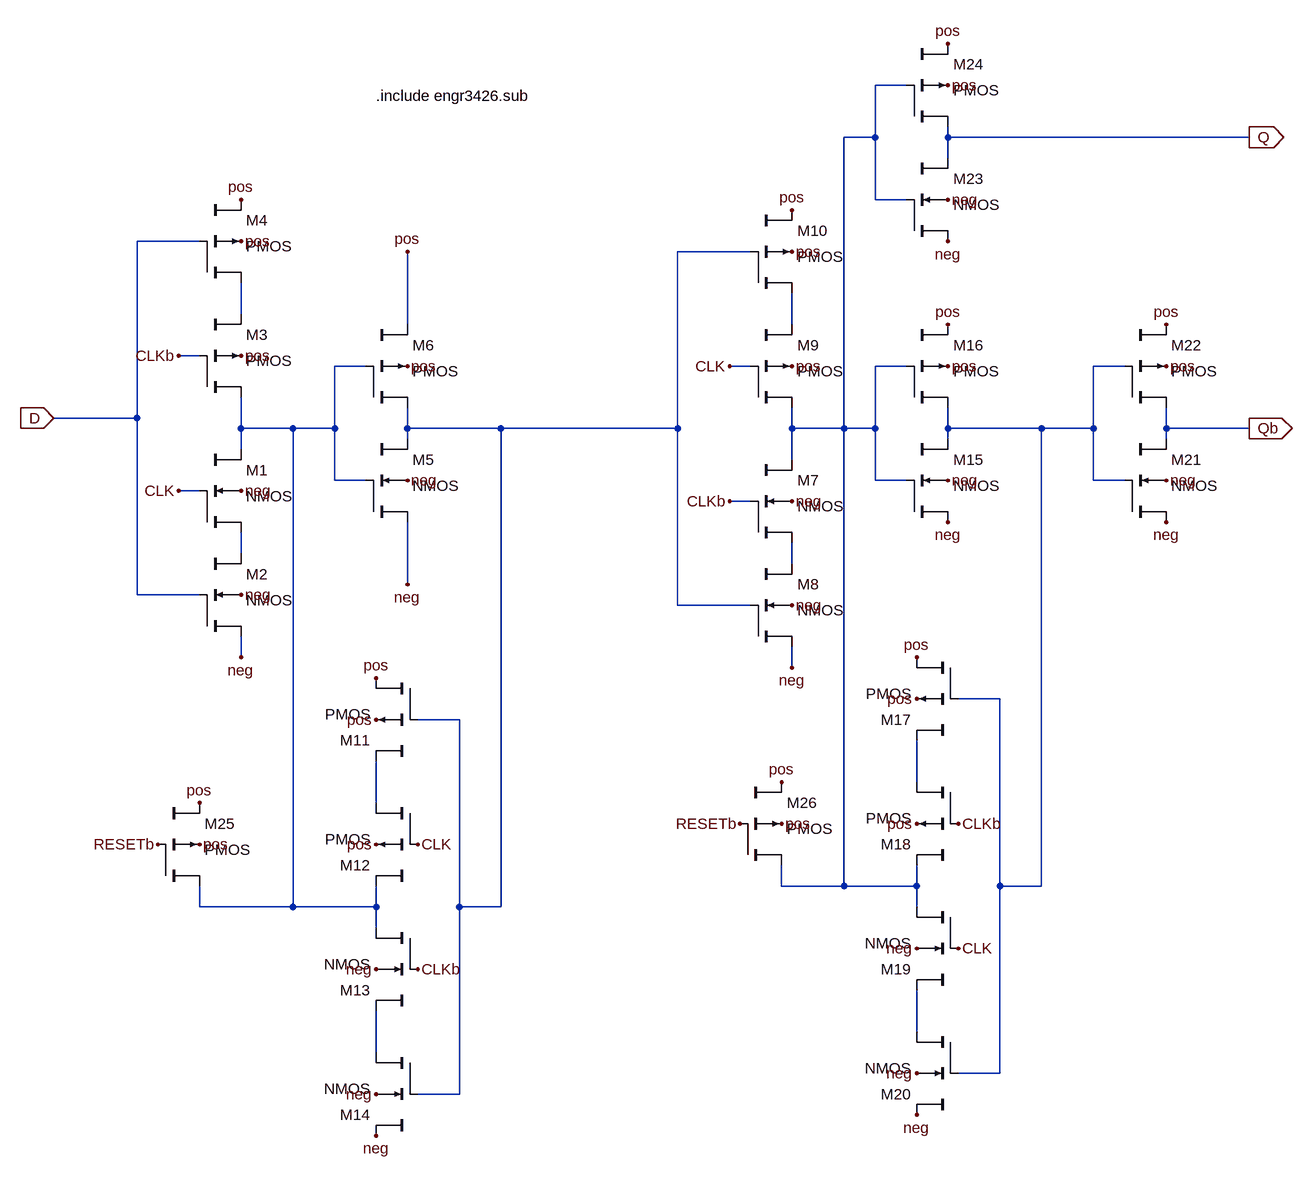
[diagram p0: schematic FlipFlop.asc]
FlipFlop.asc, the LTspice schematic file:
Version 4
SHEET 1 880 680
WIRE -656 -1440 -704 -1440
WIRE -704 -1360 -704 -1440
WIRE -704 -1360 -752 -1360
WIRE -592 -1360 -592 -1376
WIRE -128 -1360 -592 -1360
WIRE -592 -1328 -592 -1360
WIRE -704 -1264 -704 -1360
WIRE -656 -1264 -704 -1264
WIRE -1744 -1200 -1840 -1200
WIRE -896 -1184 -1008 -1184
WIRE -1680 -1088 -1680 -1136
WIRE -1424 -1072 -1424 -1184
WIRE -832 -1072 -832 -1120
WIRE -1744 -1024 -1776 -1024
WIRE -1488 -1008 -1536 -1008
WIRE -896 -1008 -928 -1008
WIRE -656 -1008 -704 -1008
WIRE -320 -1008 -368 -1008
WIRE -1840 -928 -1840 -1200
WIRE -1840 -928 -1968 -928
WIRE -1680 -912 -1680 -960
WIRE -1600 -912 -1680 -912
WIRE -1536 -912 -1536 -1008
WIRE -1536 -912 -1600 -912
WIRE -1424 -912 -1424 -944
WIRE -1280 -912 -1424 -912
WIRE -1008 -912 -1008 -1184
WIRE -1008 -912 -1280 -912
WIRE -832 -912 -832 -944
WIRE -752 -912 -752 -1360
WIRE -752 -912 -832 -912
WIRE -704 -912 -704 -1008
WIRE -704 -912 -752 -912
WIRE -592 -912 -592 -944
WIRE -448 -912 -592 -912
WIRE -368 -912 -368 -1008
WIRE -368 -912 -448 -912
WIRE -256 -912 -256 -944
WIRE -128 -912 -256 -912
WIRE -1424 -896 -1424 -912
WIRE -592 -896 -592 -912
WIRE -256 -896 -256 -912
WIRE -1680 -880 -1680 -912
WIRE -832 -864 -832 -912
WIRE -1536 -832 -1536 -912
WIRE -1488 -832 -1536 -832
WIRE -704 -832 -704 -912
WIRE -656 -832 -704 -832
WIRE -368 -832 -368 -912
WIRE -320 -832 -368 -832
WIRE -1744 -816 -1776 -816
WIRE -896 -800 -928 -800
WIRE -1680 -720 -1680 -752
WIRE -832 -704 -832 -736
WIRE -1424 -672 -1424 -768
WIRE -1840 -656 -1840 -928
WIRE -1744 -656 -1840 -656
WIRE -1008 -640 -1008 -912
WIRE -896 -640 -1008 -640
WIRE -1680 -560 -1680 -592
WIRE -832 -544 -832 -576
WIRE -512 -496 -576 -496
WIRE -1344 -464 -1408 -464
WIRE -640 -368 -640 -432
WIRE -1472 -336 -1472 -400
WIRE -848 -208 -848 -240
WIRE -752 -208 -752 -912
WIRE -752 -208 -848 -208
WIRE -640 -208 -640 -240
WIRE -640 -208 -752 -208
WIRE -512 -208 -512 -496
WIRE -448 -208 -448 -912
WIRE -448 -208 -512 -208
WIRE -1744 -176 -1744 -208
WIRE -1600 -176 -1600 -912
WIRE -1600 -176 -1744 -176
WIRE -1472 -176 -1472 -208
WIRE -1472 -176 -1600 -176
WIRE -1344 -176 -1344 -464
WIRE -1280 -176 -1280 -912
WIRE -1280 -176 -1344 -176
WIRE -640 -176 -640 -208
WIRE -1472 -144 -1472 -176
WIRE -640 16 -640 -48
WIRE -1472 48 -1472 -16
WIRE -512 80 -512 -208
WIRE -512 80 -576 80
WIRE -1344 112 -1344 -176
WIRE -1344 112 -1408 112
FLAG -1680 -1264 pos
FLAG -1968 -928 D
IOPIN -1968 -928 In
FLAG -1776 -1024 CLKb
FLAG -1776 -816 CLK
FLAG -1680 -1024 pos
FLAG -1680 -1200 pos
FLAG -1680 -816 neg
FLAG -1680 -656 neg
FLAG -1680 -560 neg
FLAG -1424 -1184 pos
FLAG -1424 -1008 pos
FLAG -1424 -832 neg
FLAG -1424 -672 neg
FLAG -832 -1248 pos
FLAG -832 -1008 pos
FLAG -832 -1184 pos
FLAG -832 -800 neg
FLAG -832 -640 neg
FLAG -832 -544 neg
FLAG -1472 -528 pos
FLAG -1472 -464 pos
FLAG -1472 -272 pos
FLAG -1472 176 neg
FLAG -1472 112 neg
FLAG -1472 -80 neg
FLAG -592 -1008 pos
FLAG -592 -832 neg
FLAG -640 -560 pos
FLAG -640 -496 pos
FLAG -640 -304 pos
FLAG -640 144 neg
FLAG -640 80 neg
FLAG -640 -112 neg
FLAG -592 -768 neg
FLAG -592 -1072 pos
FLAG -256 -1008 pos
FLAG -256 -832 neg
FLAG -256 -768 neg
FLAG -256 -1072 pos
FLAG -128 -912 Qb
IOPIN -128 -912 Out
FLAG -128 -1360 Q
IOPIN -128 -1360 Out
FLAG -928 -1008 CLK
FLAG -928 -800 CLKb
FLAG -1408 -272 CLK
FLAG -1408 -80 CLKb
FLAG -576 -304 CLKb
FLAG -576 -112 CLK
FLAG -592 -1440 pos
FLAG -592 -1264 neg
FLAG -592 -1200 neg
FLAG -592 -1504 pos
FLAG -1808 -272 RESETb
FLAG -1744 -336 pos
FLAG -1744 -272 pos
FLAG -912 -304 RESETb
FLAG -848 -368 pos
FLAG -848 -304 pos
SYMBOL cktsym\\nmos4 -1680 -816 R0
SYMATTR InstName M1
SYMATTR Value2 l=nmosL w=nmosW
SYMBOL cktsym\\nmos4 -1680 -656 R0
SYMATTR InstName M2
SYMATTR Value2 l=nmosL w=nmosW
SYMBOL cktsym\\pmos4 -1680 -1024 R0
SYMATTR InstName M3
SYMATTR Value2 l=pmosL w=pmosW
SYMBOL cktsym\\pmos4 -1680 -1200 R0
SYMATTR InstName M4
SYMATTR Value2 l=pmosL w=pmosW
SYMBOL cktsym\\nmos4 -1424 -832 R0
SYMATTR InstName M5
SYMATTR Value2 l=nmosL w=nmosW
SYMBOL cktsym\\pmos4 -1424 -1008 R0
SYMATTR InstName M6
SYMATTR Value2 l=pmosL w=pmosW
SYMBOL cktsym\\nmos4 -832 -800 R0
SYMATTR InstName M7
SYMATTR Value2 l=nmosL w=nmosW
SYMBOL cktsym\\nmos4 -832 -640 R0
SYMATTR InstName M8
SYMATTR Value2 l=nmosL w=nmosW
SYMBOL cktsym\\pmos4 -832 -1008 R0
SYMATTR InstName M9
SYMATTR Value2 l=pmosL w=pmosW
SYMBOL cktsym\\pmos4 -832 -1184 R0
SYMATTR InstName M10
SYMATTR Value2 l=pmosL w=pmosW
SYMBOL cktsym\\pmos4 -1472 -464 R180
SYMATTR InstName M11
SYMATTR Value2 l=pmosL w=pmosW
SYMBOL cktsym\\pmos4 -1472 -272 R180
SYMATTR InstName M12
SYMATTR Value2 l=pmosL w=pmosW
SYMBOL cktsym\\nmos4 -1472 -80 R180
SYMATTR InstName M13
SYMATTR Value2 l=nmosL w=nmosW
SYMBOL cktsym\\nmos4 -1472 112 R180
SYMATTR InstName M14
SYMATTR Value2 l=nmosL w=nmosW
SYMBOL cktsym\\nmos4 -592 -832 R0
SYMATTR InstName M15
SYMATTR Value2 l=nmosL w=nmosW
SYMBOL cktsym\\pmos4 -592 -1008 R0
SYMATTR InstName M16
SYMATTR Value2 l=pmosL w=pmosW
SYMBOL cktsym\\pmos4 -640 -496 R180
SYMATTR InstName M17
SYMATTR Value2 l=pmosL w=pmosW
SYMBOL cktsym\\pmos4 -640 -304 R180
SYMATTR InstName M18
SYMATTR Value2 l=pmosL w=pmosW
SYMBOL cktsym\\nmos4 -640 -112 R180
SYMATTR InstName M19
SYMATTR Value2 l=nmosL w=nmosW
SYMBOL cktsym\\nmos4 -640 80 R180
SYMATTR InstName M20
SYMATTR Value2 l=nmosL w=nmosW
SYMBOL cktsym\\nmos4 -256 -832 R0
SYMATTR InstName M21
SYMATTR Value2 l=nmosL w=nmosW
SYMBOL cktsym\\pmos4 -256 -1008 R0
SYMATTR InstName M22
SYMATTR Value2 l=pmosL w=pmosW
SYMBOL cktsym\\nmos4 -592 -1264 R0
SYMATTR InstName M23
SYMATTR Value2 l=nmosL w=nmosW
SYMBOL cktsym\\pmos4 -592 -1440 R0
SYMATTR InstName M24
SYMATTR Value2 l=pmosL w=pmosW
SYMBOL cktsym\\pmos4 -1744 -272 R0
SYMATTR InstName M25
SYMATTR Value2 l=pmosL w={6*pmosW}
SYMBOL cktsym\\pmos4 -848 -304 R0
SYMATTR InstName M26
SYMATTR Value2 l=pmosL w={6*pmosW}
TEXT -1472 -1424 Left 2 !.include engr3426.sub

The netlist it stands for:
* FlipFlop.asc
M1 N005 CLK N007 neg NMOS l=nmosL w=nmosW
M2 N007 D neg neg NMOS l=nmosL w=nmosW
M3 N005 CLKb N003 pos PMOS l=pmosL w=pmosW
M4 N003 D pos pos PMOS l=pmosL w=pmosW
M5 N002 N005 neg neg NMOS l=nmosL w=nmosW
M6 N002 N005 pos pos PMOS l=pmosL w=pmosW
M7 N001 CLKb N008 neg NMOS l=nmosL w=nmosW
M8 N008 N002 neg neg NMOS l=nmosL w=nmosW
M9 N001 CLK N004 pos PMOS l=pmosL w=pmosW
M10 N004 N002 pos pos PMOS l=pmosL w=pmosW
M11 pos N002 N010 pos PMOS l=pmosL w=pmosW
M12 N010 CLK N005 pos PMOS l=pmosL w=pmosW
M13 N012 CLKb N005 neg NMOS l=nmosL w=nmosW
M14 neg N002 N012 neg NMOS l=nmosL w=nmosW
M15 N006 N001 neg neg NMOS l=nmosL w=nmosW
M16 N006 N001 pos pos PMOS l=pmosL w=pmosW
M17 pos N006 N009 pos PMOS l=pmosL w=pmosW
M18 N009 CLKb N001 pos PMOS l=pmosL w=pmosW
M19 N011 CLK N001 neg NMOS l=nmosL w=nmosW
M20 neg N006 N011 neg NMOS l=nmosL w=nmosW
M21 Qb N006 neg neg NMOS l=nmosL w=nmosW
M22 Qb N006 pos pos PMOS l=pmosL w=pmosW
M23 Q N001 neg neg NMOS l=nmosL w=nmosW
M24 Q N001 pos pos PMOS l=pmosL w=pmosW
M25 N005 RESETb pos pos PMOS l=pmosL w={6*pmosW}
M26 N001 RESETb pos pos PMOS l=pmosL w={6*pmosW}
.model NMOS NMOS
.model PMOS PMOS
.lib standard.mos
.include engr3426.sub
.backanno
.end